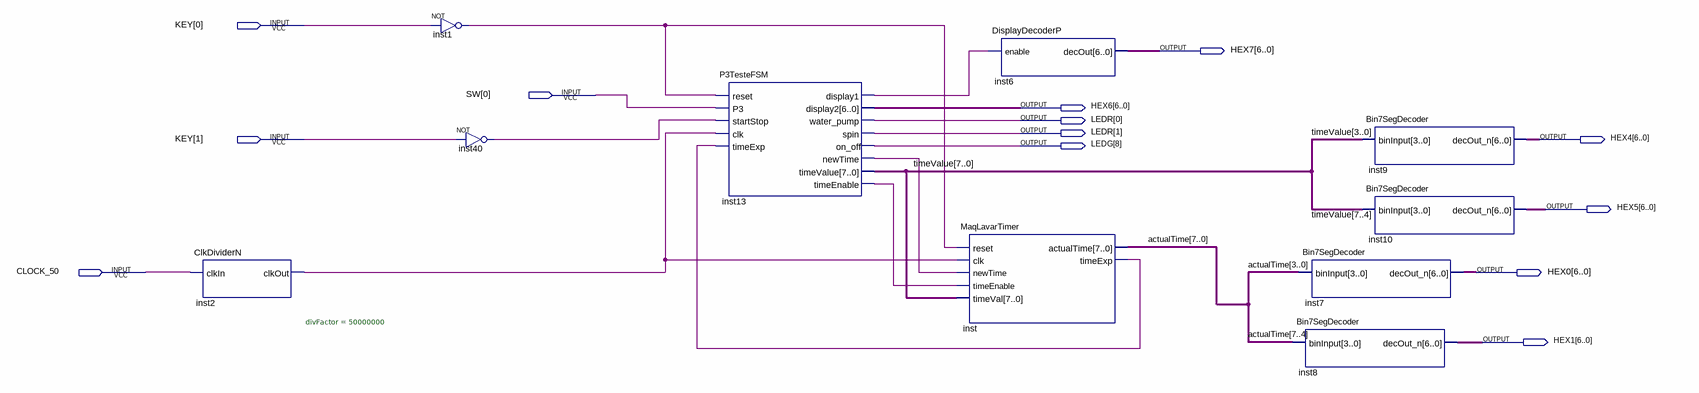
[diagram p0: schematic sheet]
// Quartus schematic P3Teste.bdf as structural Verilog: 10 symbols, 13 pins
module P3Teste (
  input  [1:0] KEY,
  input  [0:0] SW,
  input  CLOCK_50,
  output [6:0] HEX7,
  output [6:0] HEX6,
  output [1:0] LEDR,
  output [6:0] HEX4,
  output [8:8] LEDG,
  output [6:0] HEX5,
  output [6:0] HEX0,
  output [6:0] HEX1
);

  wire inst1_out, inst2_clkout, inst13_display1, inst13_newtime, inst13_timeenable, inst40_out, inst_timeexp;
  wire [7:0] actualTime, timeValue;

  ClkDividerN #(.divFactor(50000000)) inst2 (.clkIn(CLOCK_50), .clkOut(inst2_clkout));
  not inst1 (inst1_out, KEY[0]);
  not inst40 (inst40_out, KEY[1]);
  P3TesteFSM inst13 (
    .reset(inst1_out), .P3(SW[0]), .startStop(inst40_out), .clk(inst2_clkout), .timeExp(inst_timeexp),
    .display1(inst13_display1), .display2(HEX6), .water_pump(LEDR[0]), .spin(LEDR[1]), .on_off(LEDG[8]),
    .newTime(inst13_newtime), .timeValue(timeValue), .timeEnable(inst13_timeenable));
  MaqLavarTimer inst (
    .reset(inst1_out), .clk(inst2_clkout), .newTime(inst13_newtime), .timeEnable(inst13_timeenable),
    .timeVal(timeValue), .actualTime(actualTime), .timeExp(inst_timeexp));
  DisplayDecoderP inst6 (.enable(inst13_display1), .decOut(HEX7));
  Bin7SegDecoder inst7 (.binInput(actualTime[3:0]), .decOut_n(HEX0));
  Bin7SegDecoder inst8 (.binInput(actualTime[7:4]), .decOut_n(HEX1));
  Bin7SegDecoder inst9 (.binInput(timeValue[3:0]), .decOut_n(HEX4));
  Bin7SegDecoder inst10 (.binInput(timeValue[7:4]), .decOut_n(HEX5));
endmodule
